# Altium schematic sheet Reset.SchDoc
size A
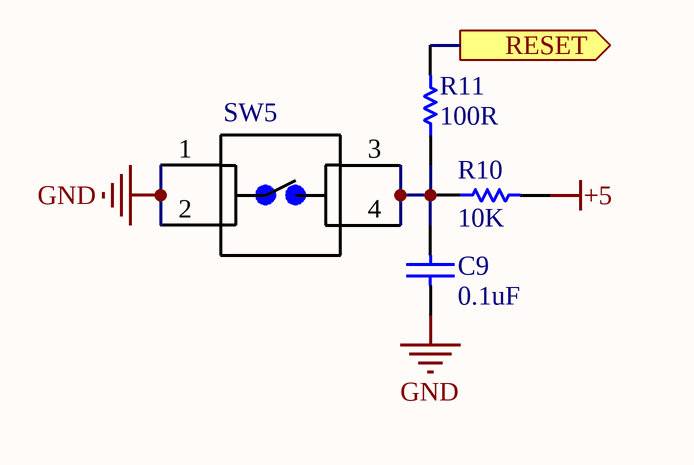
[diagram p0: Reset.SchDoc]

## Parts
C9  0.1uF  [CAPC2013X94X50LL20T25]
R10  10K  [RESC0805(2012)_L]
R11  100R  [RESC0805(2012)_L]
SW5  1825910-7  [Switch 6mm 24V (NO)]  (value not drawn)

## Ports
RESET (out)

## Nets
+5: R10.2
GND: C9.1 SW5.1 SW5.2
RESET: R11.2 ; port RESET
NetC9_2: C9.2 R10.1 R11.1 SW5.3 SW5.4

## Library data of the parts
C9 = CMP-2000-05808-1: Chip Capacitor, 0.1 uF, +/- 5%, 50 V, -55 to 125 degC, 0805 (2012 Metric), RoHS, Tape and Reel; Case Width: 1.25mm; Case Length: 2.01mm; Case Height: 0.94mm; Brand: AVX; Type: StandardX7RMLCCs; Capacitance - nF: 100nF; Dissipation Factor DF: 2.5; Voltage Rating DC: 50V; Temperature Coefficient / Code: +/-15%; Capacitance - pF: 100000pF; Dielectric: X7R; Dimensions: 1.25mmWx2.01mmLx0.94mmH; Product: GeneralTypeMLCCs; Package Description: 2-Pin Surface Mount Device, Body 2.01 x 1.25 mm; Capacitance: 0.1uF; Package / Case: 0805(2012metric); Product Category: MultilayerCeramicCapacitorsMLCC-SMD/SMT; Case Code - mm: 2012; Packaging: Reel; Manufacturer URL: http://www.avx.com/; Operating Temperature Range: -55Cto+125C; Termination Style: SMD/SMT; Maximum Operating Temperature: +125C; Case Code - in: 0805; Minimum Operating Temperature: -55C; Factory Pack Quantity: 4000; RoHS: Details; Voltage Rating: 50V; Tolerance: 5%; Package Reference: 0805; Datasheet URL: http://www.farnell.com/datasheets/1679506.pdf; Manufacturer: AVX; Mounting Technology: SurfaceMount; Datasheet Version: 11/2012
R10 = CMP-1013-00624-1: 10K2 0.125W 1% 0805 (2012 Metric)  SMD; Case-Metric: 2012; Case-EIA: 0805; Value: 10200.00 Ohm; Technology: SMT; Tolerance: 1 %; Power: 0.125 W
R11 = CMP-1013-00397-1: 100R 0.125W 1% 0805 (2012 Metric)  SMD; Value: 100.00 Ohm; Case-Metric: 2012; Case-EIA: 0805; Technology: SMT; Power: 0.125 W; Tolerance: 1 %
SW5 = Switch 6mm 24V (NO): FSM4JAH=6MM TACT SWITCH, HIGH TEMP; MF: TE Connectivity; Contact_Current_Rating: 50 mA; Configuration_Pole-Throw: Single Pole - Single Throw; Package: None; Digi-Key_Part_Number: 450-1804-ND; Digi-Key_Purchase_URL: https://www.digikey.com/product-detail/en/te-connectivity-alcoswitch-switches/1825910-7/450-1804-ND/1731414?utm_source=snapeda&utm_medium=aggregator&utm_campaign=symbol; MP: 1825910-7; SnapEDA_Link: https://www.snapeda.com/parts/1825910-7/TE%20Connectivity%20ALCOSWITCH%20Switches/view-part/?ref=snap; EU_RoHS_Compliance: Compliant; TE_purchase_URL: https://www.te.com/usa-en/product-1825910-7.html?te_bu=Cor&te_type=disp&te_campaign=seda_glo_cor-seda-global-disp-prtnr-fy19-seda-model-bom-cta_sma-317_1&elqCampaignId=32493; Value: *